# Altium schematic sheet Sheet2_WITI_Board_USB.SchDoc: Koruza Expander Board
size A4; Date: 12.7.2016; Author: Matej Gomboc; CompanyName: Institute IRNAS Rače; Revision: 1.0; SheetNumber: 2; SheetTotal: 4; CurrentDate: 12.7.2016
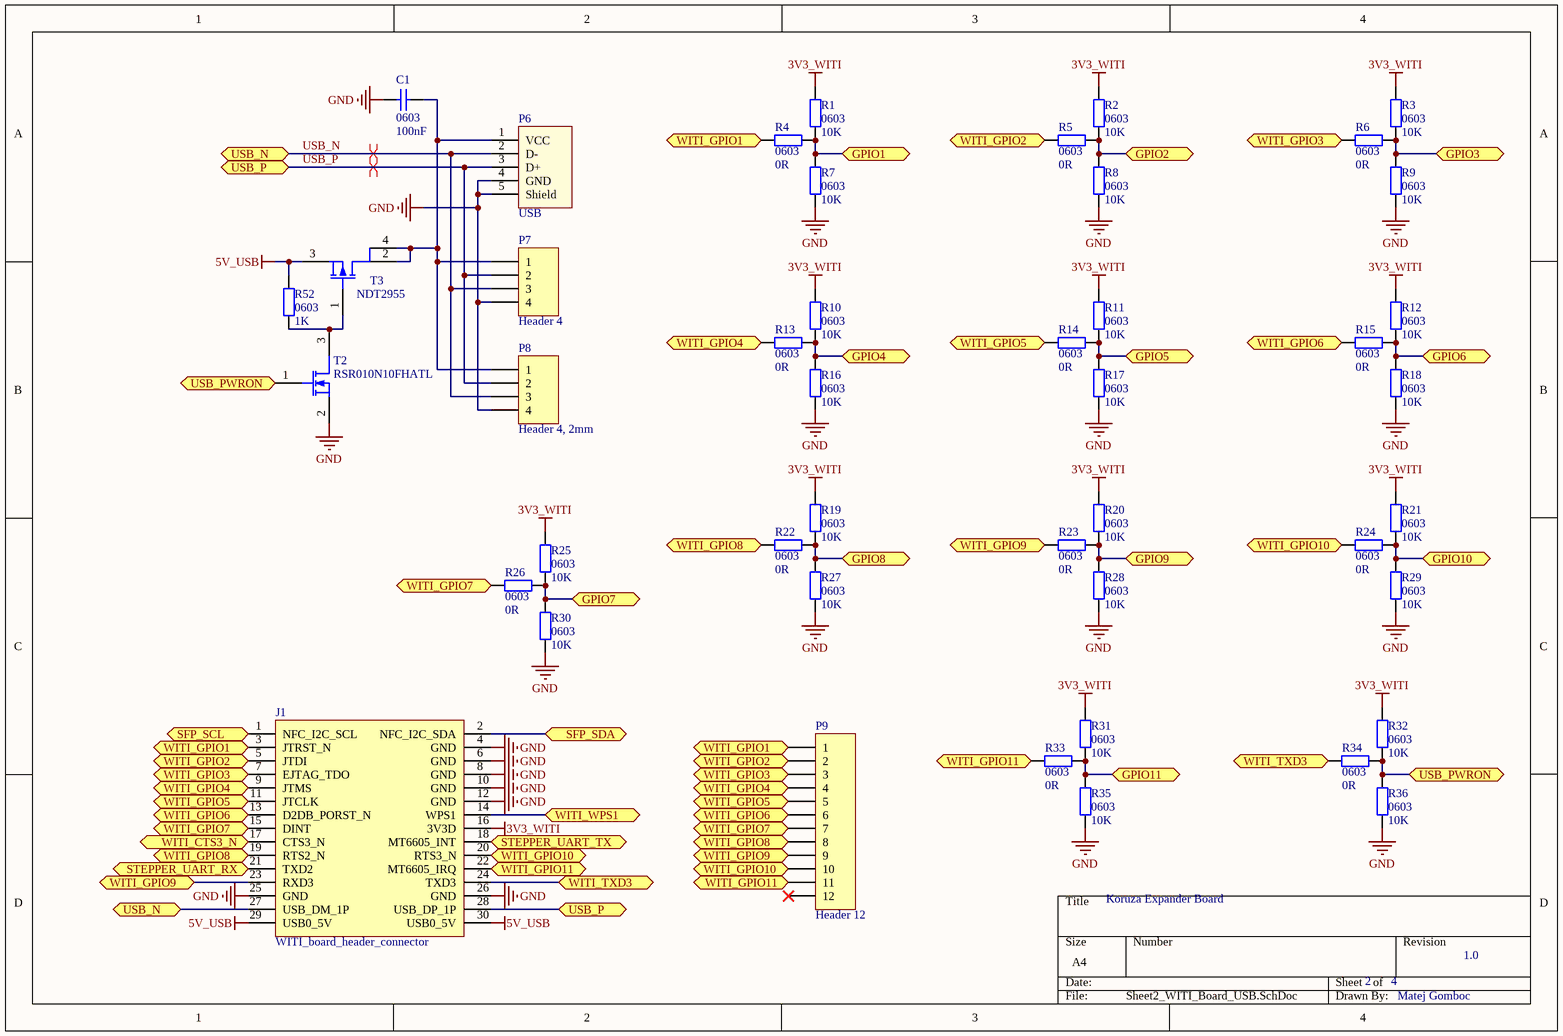
[diagram p0: Sheet2_WITI_Board_USB.SchDoc]

## Parts
C1  0603  value 100nF  [0603_HandSoldering]
J1  WITI_board_header_connector  [HDR2X15]
P6  USB  [USB A THT]
P7  Header 4  [HDR1X4]
P8  Header 4, 2mm  [HDR1X4_2mm]
P9  Header 12  [HDR1X12]
R1  0603  value 10K  [0603_HandSoldering]
R2  0603  value 10K  [0603_HandSoldering]
R3  0603  value 10K  [0603_HandSoldering]
R4  0603  value 0R  [0603_HandSoldering]
R5  0603  value 0R  [0603_HandSoldering]
R6  0603  value 0R  [0603_HandSoldering]
R7  0603  value 10K  [0603_HandSoldering]
R8  0603  value 10K  [0603_HandSoldering]
R9  0603  value 10K  [0603_HandSoldering]
R10  0603  value 10K  [0603_HandSoldering]
R11  0603  value 10K  [0603_HandSoldering]
R12  0603  value 10K  [0603_HandSoldering]
R13  0603  value 0R  [0603_HandSoldering]
R14  0603  value 0R  [0603_HandSoldering]
R15  0603  value 0R  [0603_HandSoldering]
R16  0603  value 10K  [0603_HandSoldering]
R17  0603  value 10K  [0603_HandSoldering]
R18  0603  value 10K  [0603_HandSoldering]
R19  0603  value 10K  [0603_HandSoldering]
R20  0603  value 10K  [0603_HandSoldering]
R21  0603  value 10K  [0603_HandSoldering]
R22  0603  value 0R  [0603_HandSoldering]
R23  0603  value 0R  [0603_HandSoldering]
R24  0603  value 0R  [0603_HandSoldering]
R25  0603  value 10K  [0603_HandSoldering]
R26  0603  value 0R  [0603_HandSoldering]
R27  0603  value 10K  [0603_HandSoldering]
R28  0603  value 10K  [0603_HandSoldering]
R29  0603  value 10K  [0603_HandSoldering]
R30  0603  value 10K  [0603_HandSoldering]
R31  0603  value 10K  [0603_HandSoldering]
R32  0603  value 10K  [0603_HandSoldering]
R33  0603  value 0R  [0603_HandSoldering]
R34  0603  value 0R  [0603_HandSoldering]
R35  0603  value 10K  [0603_HandSoldering]
R36  0603  value 10K  [0603_HandSoldering]
R52  0603  value 1K  [0603_HandSoldering]
T2  RSR010N10FHATL  [SOT23-3]
T3  NDT2955  [SOT230P700X180-4N]

## Ports
GPIO1, GPIO2, GPIO3, GPIO4, GPIO5, GPIO6, GPIO7, GPIO8, GPIO9, GPIO10, GPIO11, SFP_SCL, SFP_SDA, STEPPER_UART_RX, STEPPER_UART_TX, USB_N, USB_P, USB_PWRON, WITI_CTS3_N, WITI_GPIO1, WITI_GPIO2, WITI_GPIO3, WITI_GPIO4, WITI_GPIO5, WITI_GPIO6, WITI_GPIO7, WITI_GPIO8, WITI_GPIO9, WITI_GPIO10, WITI_GPIO11, WITI_TXD3, WITI_WPS1

## Nets
3V3_WITI: J1.16(3V3D) R1.2 R2.2 R3.2 R10.2 R11.2 R12.2 R19.2 R20.2 R21.2 R25.2 R31.2 R32.2
5V_USB: J1.29(USB0_5V) J1.30(USB0_5V) R52.2 T3.3(S)
GND: C1.1 J1.4(GND) J1.6(GND) J1.8(GND) J1.10(GND) J1.12(GND) J1.25(GND) J1.26(GND) P6.4(GND) P6.5(Shield) P7.4 P8.4 R7.1 R8.1 R9.1 R16.1 R17.1 R18.1 R27.1 R28.1 R29.1 R30.1 R35.1 R36.1 T2.2(S)
GPIO1: R1.1 R4.2 R7.2 ; port GPIO1
GPIO2: R2.1 R5.2 R8.2 ; port GPIO2
GPIO3: R3.1 R6.2 R9.2 ; port GPIO3
GPIO4: R10.1 R13.2 R16.2 ; port GPIO4
GPIO5: R11.1 R14.2 R17.2 ; port GPIO5
GPIO6: R12.1 R15.2 R18.2 ; port GPIO6
GPIO7: R25.1 R26.2 R30.2 ; port GPIO7
GPIO8: R19.1 R22.2 R27.2 ; port GPIO8
GPIO9: R20.1 R23.2 R28.2 ; port GPIO9
GPIO10: R21.1 R24.2 R29.2 ; port GPIO10
GPIO11: R31.1 R33.2 R35.2 ; port GPIO11
SFP_SCL: J1.1(NFC_I2C_SCL) ; port SFP_SCL
SFP_SDA: J1.2(NFC_I2C_SDA) ; port SFP_SDA
STEPPER_UART_RX: J1.21(TXD2) ; port STEPPER_UART_RX
STEPPER_UART_TX: J1.18(MT6605_INT) ; port STEPPER_UART_TX
USB_N: J1.27(USB_DM_1P) P6.2(D-) P7.3 P8.3 ; port USB_N
USB_P: J1.28(USB_DP_1P) P6.3(D+) P7.2 P8.2 ; port USB_P
USB_PWRON: R32.1 R34.2 R36.2 T2.1(G) ; port USB_PWRON
WITI_CTS3_N: J1.17(CTS3_N) ; port WITI_CTS3_N
WITI_GPIO1: J1.3(JTRST_N) P9.1 R4.1 ; port WITI_GPIO1
WITI_GPIO2: J1.5(JTDI) P9.2 R5.1 ; port WITI_GPIO2
WITI_GPIO3: J1.7(EJTAG_TDO) P9.3 R6.1 ; port WITI_GPIO3
WITI_GPIO4: J1.9(JTMS) P9.4 R13.1 ; port WITI_GPIO4
WITI_GPIO5: J1.11(JTCLK) P9.5 R14.1 ; port WITI_GPIO5
WITI_GPIO6: J1.13(D2DB_PORST_N) P9.6 R15.1 ; port WITI_GPIO6
WITI_GPIO7: J1.15(DINT) P9.7 R26.1 ; port WITI_GPIO7
WITI_GPIO8: J1.19(RTS2_N) P9.8 R22.1 ; port WITI_GPIO8
WITI_GPIO9: J1.23(RXD3) P9.9 R23.1 ; port WITI_GPIO9
WITI_GPIO10: J1.20(RTS3_N) P9.10 R24.1 ; port WITI_GPIO10
WITI_GPIO11: J1.22(MT6605_IRQ) P9.11 R33.1 ; port WITI_GPIO11
WITI_TXD3: J1.24(TXD3) R34.1 ; port WITI_TXD3
WITI_WPS1: J1.14(WPS1) ; port WITI_WPS1
NetC1_2: C1.2 P6.1(VCC) P7.1 P8.1 T3.2(D) T3.4(D)
NetR52_1: R52.1 T2.3(D) T3.1(G)

Not connected (* = marked no-connect by the designer): P9 12*

## Layout directives
differential pair: USB_N, USB_P

## Library data of the parts
C1 = capacitor_ceramic: Ceramic Capacitor
J1 = WITI_board_header_connector: WITI board header connector
P6 = USB: USB A standard receptacle
P7 = Header 4: Header, 4-Pin
P8 = Header 4 - 2mm: Header, 4-Pin, 2mm
P9 = Header 12: Header, 12-Pin
R1-R36 R52 = resistor
T2 = RSR010N10FHATL: N MOSFET
T3 = NDT2955: P MOSFET